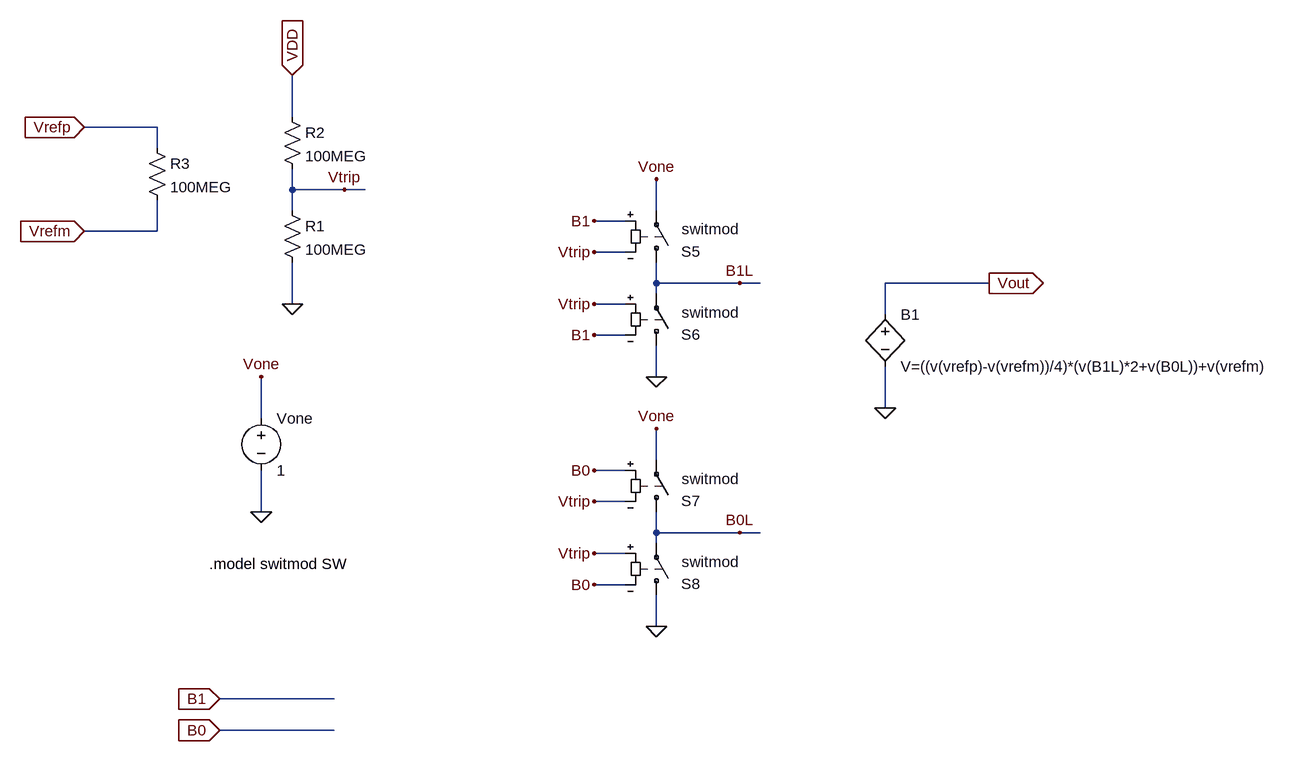
[diagram p0: schematic ideal_2_bit_dac.asc]
ideal_2_bit_dac.asc, the LTspice schematic file:
Version 4
SHEET 1 3096 1316
WIRE 528 -192 528 -256
WIRE 320 -176 208 -176
WIRE 320 -144 320 -176
WIRE 528 -80 528 -112
WIRE 608 -80 528 -80
WIRE 640 -80 608 -80
WIRE 528 -48 528 -80
WIRE 1088 -48 1088 -96
WIRE 1040 -32 992 -32
WIRE 320 -16 320 -64
WIRE 320 -16 208 -16
WIRE 1040 16 992 16
WIRE 1088 64 1088 32
WIRE 1216 64 1088 64
WIRE 1248 64 1216 64
WIRE 1600 64 1440 64
WIRE 1088 80 1088 64
WIRE 528 96 528 32
WIRE 1040 96 992 96
WIRE 1440 112 1440 64
WIRE 1040 144 992 144
WIRE 1088 208 1088 160
WIRE 1440 256 1440 192
WIRE 480 272 480 208
WIRE 1088 336 1088 288
WIRE 1040 352 992 352
WIRE 1040 400 992 400
WIRE 480 416 480 352
WIRE 1088 448 1088 416
WIRE 1216 448 1088 448
WIRE 1248 448 1216 448
WIRE 1088 464 1088 448
WIRE 1040 480 992 480
WIRE 1040 528 992 528
WIRE 1088 592 1088 544
WIRE 592 704 416 704
WIRE 592 752 416 752
FLAG 608 -80 Vtrip
FLAG 528 -256 VDD
IOPIN 528 -256 In
FLAG 1440 256 0
FLAG 1600 64 Vout
IOPIN 1600 64 Out
FLAG 208 -176 Vrefp
IOPIN 208 -176 In
FLAG 208 -16 Vrefm
IOPIN 208 -16 In
FLAG 416 704 B1
IOPIN 416 704 In
FLAG 416 752 B0
IOPIN 416 752 In
FLAG 528 96 0
FLAG 480 416 0
FLAG 480 208 Vone
FLAG 992 -32 B1
FLAG 992 16 Vtrip
FLAG 992 96 Vtrip
FLAG 992 144 B1
FLAG 1216 64 B1L
FLAG 1088 208 0
FLAG 992 352 B0
FLAG 992 400 Vtrip
FLAG 992 480 Vtrip
FLAG 992 528 B0
FLAG 1216 448 B0L
FLAG 1088 592 0
FLAG 1088 -96 Vone
FLAG 1088 288 Vone
SYMBOL res 512 -64 R0
SYMATTR InstName R1
SYMATTR Value 100MEG
SYMBOL res 512 -208 R0
SYMATTR InstName R2
SYMATTR Value 100MEG
SYMBOL bv 1440 96 R0
SYMATTR InstName B1
SYMATTR Value V=((v(vrefp)-v(vrefm))/4)*(v(B1L)*2+v(B0L))+v(vrefm)
SYMBOL res 304 -160 R0
SYMATTR InstName R3
SYMATTR Value 100MEG
SYMBOL voltage 480 256 R0
WINDOW 123 0 0 Left 0
WINDOW 39 0 0 Left 0
SYMATTR InstName Vone
SYMATTR Value 1
SYMBOL sw 1088 48 M180
WINDOW 3 24 -12 Left 0
WINDOW 38 39 67 Left 0
WINDOW 0 38 33 Left 0
SYMATTR Value ""
SYMATTR SpiceModel switmod
SYMATTR InstName S5
SYMBOL sw 1088 176 M180
WINDOW 3 24 -12 Left 0
WINDOW 38 39 67 Left 0
WINDOW 0 38 33 Left 0
SYMATTR Value ""
SYMATTR SpiceModel switmod
SYMATTR InstName S6
SYMBOL sw 1088 432 M180
WINDOW 3 24 -12 Left 0
WINDOW 38 39 67 Left 0
WINDOW 0 38 33 Left 0
SYMATTR Value ""
SYMATTR SpiceModel switmod
SYMATTR InstName S7
SYMBOL sw 1088 560 M180
WINDOW 3 24 -12 Left 0
WINDOW 38 39 67 Left 0
WINDOW 0 38 33 Left 0
SYMATTR Value ""
SYMATTR SpiceModel switmod
SYMATTR InstName S8
TEXT 400 496 Left 0 !.model switmod SW

The netlist it stands for:
* ideal_2_bit_dac.asc
R1 Vtrip 0 100MEG
R2 VDD Vtrip 100MEG
B1 Vout 0 V=((v(vrefp)-v(vrefm))/4)*(v(B1L)*2+v(B0L))+v(vrefm)
R3 Vrefp Vrefm 100MEG
Vone Vone 0 1
S5 B1L Vone B1 Vtrip switmod
S6 0 B1L Vtrip B1 switmod
S7 B0L Vone B0 Vtrip switmod
S8 0 B0L Vtrip B0 switmod
.model switmod SW
.backanno
.end